# Altium schematic sheet Super_iron.SchDoc
size A4
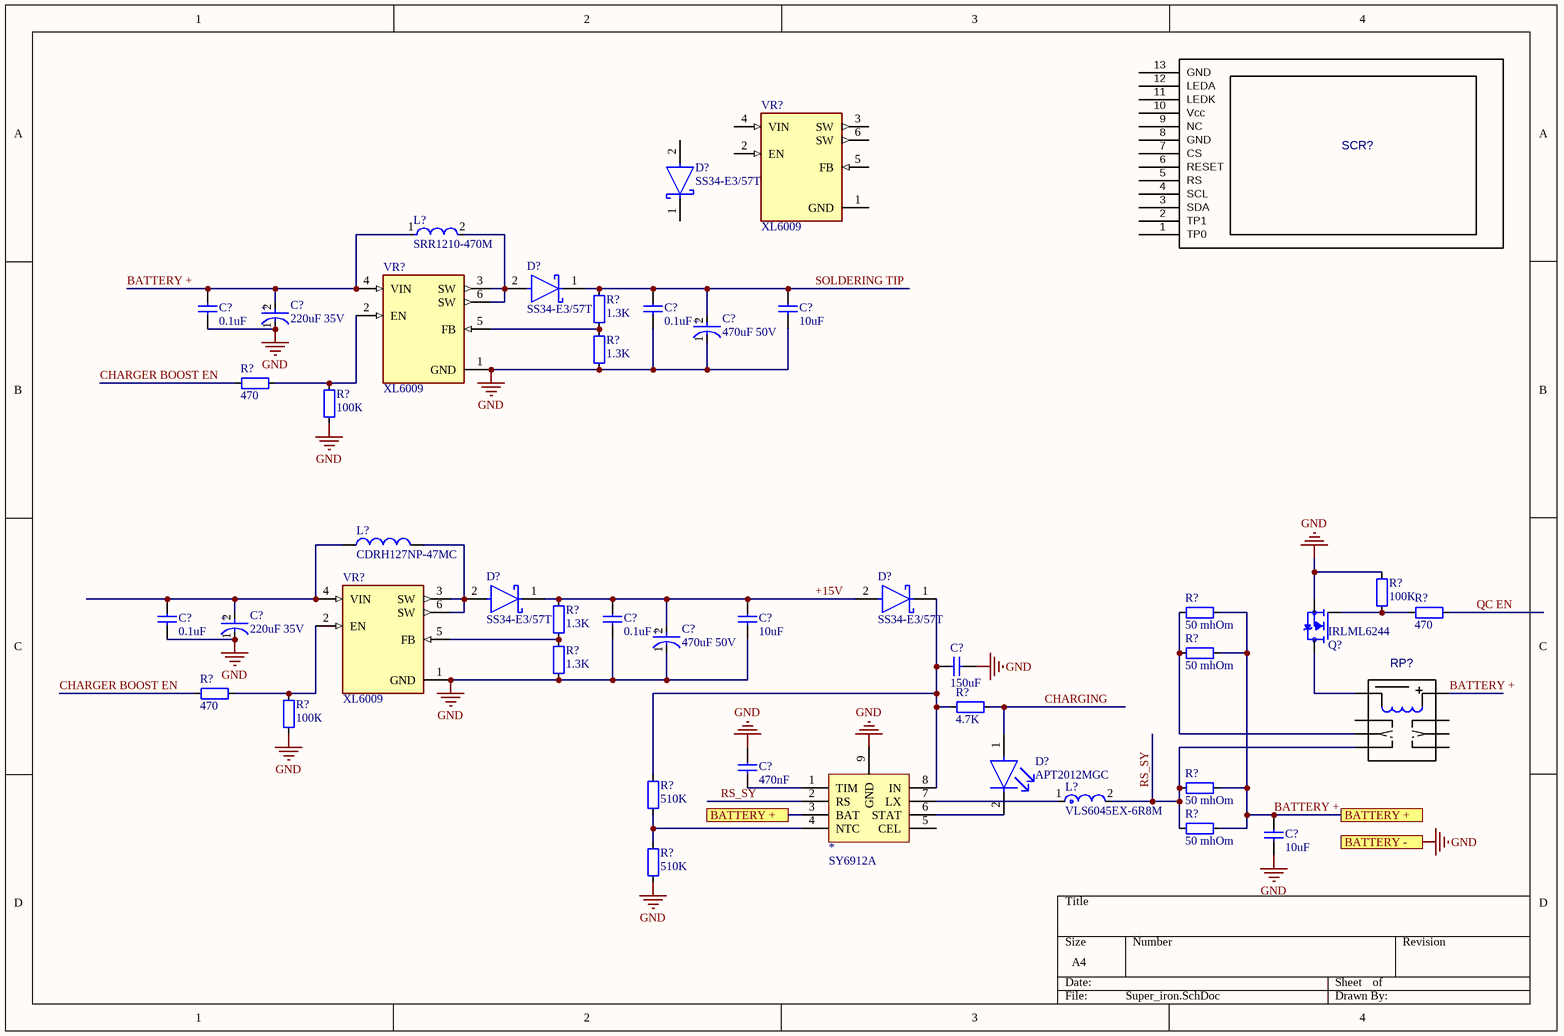
[diagram p0: Super_iron.SchDoc]

## Parts
(Parts that share a designator on the sheet are numbered #1, #2 ... from top to bottom, then left to right.)
*  SY6912A  [SO8]
C?#1  220uF 35V  [FP-RAD-TH-D_8_0_5-L_15_1-MFG]
C?#2  470uF 50V  [FP-RAD-TH-D_10_0_5-L_20_2-MFG]
C?#3  0.1uF  [1206]
C?#4  0.1uF  [1206]
C?#5  10uF  [CAPC1005X04L]
C?#6  220uF 35V  [FP-RAD-TH-D_8_0_5-L_15_1-MFG]
C?#7  470uF 50V  [FP-RAD-TH-D_10_0_5-L_20_2-MFG]
C?#8  0.1uF  [1206]
C?#9  0.1uF  [1206]
C?#10  10uF  [CAPC1005X04L]
C?#11  150uF  [CAPC1005X04L]
C?#12  470nF  [C0805]
C?#13  10uF  [CAPC1005X04L]
D?#1  SS34-E3/57T  [FP-95402-MFG]
D?#2  SS34-E3/57T  [FP-95402-MFG]
D?#3  SS34-E3/57T  [FP-95402-MFG]
D?#4  SS34-E3/57T  [FP-95402-MFG]
D?#5  APT2012MGC  [FP-APT2012MGC-MFG]
L?#1  SRR1210-470M  [FP-SRR1210-MFG]
L?#2  CDRH127NP-47MC  [SUMI-CDRH127_V]
L?#3  VLS6045EX-6R8M  [FP-VLS6045EX-100M-MFG]
Q?  IRLML6244  [SOT-23]
R?#1  1.3K  [C0805]
R?#2  1.3K  [C0805]
R?#3  470  [C0805]
R?#4  100К  [C0805]
R?#5  100К  [C0805]
R?#6  1.3K  [C0805]
R?#7  50 mhOm  [1206]
R?#8  470  [C0805]
R?#9  1.3K  [C0805]
R?#10  50 mhOm  [1206]
R?#11  470  [C0805]
R?#12  100К  [C0805]
R?#13  4.7K  [C0805]
R?#14  510K  [C0805]
R?#15  50 mhOm  [1206]
R?#16  50 mhOm  [1206]
R?#17  510K  [C0805]
RP?  IM03TS  [IM_THT_STANDART]  (value not drawn)
SCR?  0.96INCH_TFT  [0.96INCH_TFT]  (value not drawn)
VR?#1  XL6009  [DPAK170P1435X465-6N]
VR?#2  XL6009  [DPAK170P1435X465-6N]
VR?#3  XL6009  [DPAK170P1435X465-6N]

## Ports
BATTERY +, BATTERY -

## Nets
GND: *.9(GND) C?#1.1(C) C?#2.1(C) C?#3.1 C?#4.1 C?#5.1 C?#6.1(C) C?#7.1(C) C?#8.1 C?#9.1 C?#10.1 C?#11.2 C?#12.2 C?#13.1 Q?.2(S) R?#2.2 R?#4.2 R?#5.1 R?#9.2 R?#12.2 R?#17.2 VR?#2.1(GND) VR?#3.1(GND) ; port BATTERY -
+15V: C?#7.2(A) C?#9.2 C?#10.2 D?#3.1(C) D?#4.2(A) R?#6.1
BATTERY +: *.3(BAT) C?#1.2(A) C?#3.2 C?#13.2 L?#1.1 R?#7.2 R?#10.2 R?#15.2 R?#16.2 VR?#2.4(VIN) ; port BATTERY +
CHARGER BOOST EN: R?#3.2 R?#11.2
CHARGING: D?#5.1(A) R?#13.1
QC EN: R?#8.1
RS_SY: *.2(RS) L?#3.2 R?#15.1 R?#16.1 RP?.4
SOLDERING TIP: C?#2.2(A) C?#4.2 C?#5.2 D?#2.1(C) R?#1.1
Net*_1: *.1(TIM) C?#12.1
Net*_4: *.4(NTC) R?#14.2 R?#17.1
Net*_6: *.6(STAT) D?#5.2(C)
Net*_7: *.7(LX) L?#3.1
Net*_8: *.8(IN) C?#11.1 D?#4.1(C) R?#13.2 R?#14.1
NetC?#6_2: C?#6.2(A) C?#8.2 L?#2.1 VR?#3.4(VIN)
NetD?#2_2: D?#2.2(A) L?#1.2 VR?#2.3(SW) VR?#2.6(SW)
NetD?#3_2: D?#3.2(A) L?#2.2 VR?#3.3(SW) VR?#3.6(SW)
NetQ?_1: Q?.1(G) R?#5.2 R?#8.2
NetQ?_3: Q?.3(D) RP?.1
NetR?#1_2: R?#1.2 R?#2.1 VR?#2.5(FB)
NetR?#3_1: R?#3.1 R?#4.1 VR?#2.2(EN)
NetR?#6_2: R?#6.2 R?#9.1 VR?#3.5(FB)
NetR?#7_1: R?#7.1 R?#10.1 RP?.3
NetR?#11_1: R?#11.1 R?#12.1 VR?#3.2(EN)

Not connected (* = marked no-connect by the designer): * 5(CEL); D?#1 1(C) 2(A); RP? 2 5 6 7 8; SCR? 1(TP0) 2(TP1) 3(SDA) 4(SCL) 5(RS) 6(RESET) 7(CS) 8(GND) 9(NC) 10(Vcc) 11(LEDK) 12(LEDA) 13(GND); VR?#1 1(GND) 2(EN) 3(SW) 4(VIN) 5(FB) 6(SW)

## Buses and harness runs
bus BATTERY +

## Notes on the sheet
- (in symbol CAP 10x20) +
- (in symbol CMP-05427-000678-1) +

## Library data of the parts
C?#1 C?#6 = CMP-05427-000678-1: Aluminum Electrolytic Capacitors (Radial Lead Type) 220uF ±20% 35V; Ripple Current: 1.24A; Impedance: 41mR; Lead Length: 17mm; Life (Hours): 3000Hour; Lead Diameter: 0.6mm; Dielectric Material: Aluminium; Dissipation Factor: 0.12%; Package Quantity: 200; Tolerance: 20%; Series: FM; Voltage Rating: 35V; Lead Pitch: 3.5mm; Radiation Hardening: No; Construction: RADIAL; RoHS Compliant: Yes; REACH SVHC: Yes; Lead Free: Lead Free; Height - Seated (Max): 0.65inch; Length: 15mm; Diameter: 8mm; Mount: Through Hole; Number of Pins: 2; Height: 15mm; Voltage: 35V; Case/Package: Radial; Packaging: Bulk; Min Operating Temperature: -40°C; Voltage Rating (DC): 35V; ESR (Equivalent Series Resistance): 41mR; Capacitance: 220uF; Max Operating Temperature: 105°C; Termination: Radial
C?#2 C?#7 = CAP 10x20: Aluminum Electrolytic Capacitors (Radial Lead Type) 10uF ±20% 400V; Lead/Base Style: Straight; Lead Diameter: 0.6mm; Dissipation Factor: 0.24%; Ripple Current (AC): 80mA; Life (Hours): 2000Hour; Polarity: Polar; Dielectric Material: Aluminium; Lead Free: Lead Free; Capacitance: 10uF; Tolerance: 20%; Height: 20mm; Number of Pins: 2; Case/Package: Radial; Package Quantity: 200; REACH SVHC: No SVHC; Termination: Radial; Radiation Hardening: No; Diameter: 10mm; RoHS Compliant: Yes; Construction: RADIAL; Max Operating Temperature: 105°C; Voltage Rating: 400V; Mount: Through Hole; Voltage: 400V; Height - Seated (Max): 0.866inch; Lead Pitch: 5mm; Voltage Rating (DC): 400V; Contact Plating: Tin; Length: 20mm; Series: NHG; Min Operating Temperature: -25°C; Packaging: Bulk; Ripple Current: 80mA
C?#3-C?#5 C?#8-C?#13 = CAP
  C?#3 C?#4 C?#8 C?#9: Value: 0.1uF
  C?#5 C?#10 C?#13: Value: 10uF
  C?#11: Value: 150uF
  C?#12: Value: 470nF
D?#1-D?#4 = SS34: DIODE SCHOTTKY 40V 3A DO214AB; Manufacturer: Vishay; Max Junction Temp: +150°C; Peak Reverse Current: 0.5mA; Max Surge Forward Current: 100A; Standoff Height: 0mm; ComponentLink2Description: Datasheet; Device Class L3: Schottky Diodes; Height: 2.62mm; Max Repetitive Reverse Voltage: 40V; Lead Free: Yes; Package: 95402; Temperature Range High: +150°C; ComponentLink2URL: http://www.vishay.com/docs/88751/ss32.pdf; Temperature: -55°C to +150°C; Footprint Url: http://www.vishay.com/docs/95402/smc.pdf; Automotive: No; Forward Current: 3A; Category: Diode; Manufacturer Part Number: SS34-E3/57T; RoHS: TRUE; Device Class L2: Diodes; Mouser Description: Schottky Diodes & Rectifiers 3.0 Amp 40 Volt; Octopart: https://octopart.com/ss34-e3%2F57t-vishay-39552907; Temperature Range Low: -55°C; Device Class L1: Discrete Semiconductors; Digikey Description: DIODE SCHOTTKY 40V 3A DO214AB
D?#5 = LED 0805: LED GREEN CLEAR CHIP SMD 0805; Note: LED GREEN CLEAR CHIP SMD 0805
L?#1 = SRR1210: FIXED IND  102 MOHM SMD; Manufacturer: Bourns; Manufacturer Part Number: SRR1210-680M; Inductance: 68uH; Rms Current: 3A; Shielding: true; Q Factor: 12; Value: 68uH; Series Resistance: 102mΩ; Saturation Current: 2.7A; Tolerance: 20%; Core Material: Ferrite; Self Resonant Frequency: 3.8MHz; Test Frequency: 2.52MHz; ComponentLink2Description: Datasheet; Device Class L3: Fixed Inductors; Lead Free: Yes; Composition: Wirewound; Temperature: -40°C to +125°C; Automotive: No; RoHS: TRUE; Category: Ind; Device Class L2: Inductors; Height: 10mm; Temperature Range Low: -40°C; Package: SRR1210; Device Class L1: Passive Components; Temperature Range High: +125°C; Mouser Description: Fixed Inductors 68uH 20% SMD 1210; ComponentLink2URL: https://www.bourns.com/docs/Product-Datasheets/SRR1210.pdf; Digikey Description: FIXED IND 68UH 3A 102 MOHM SMD; Octopart: https://octopart.com/srr1210-680m-bourns-10487145
L?#2 = CMP-2000-06084-1: Power Inductor, 10 uH, +/- 20%, -40 to 100 degC, 2-Pin SMD, RoHS, Tape and Reel; Manufacturer: Sumida; Catalog Drawings: CDRH127SeriesFrontCDRH127SeriesSideCDRH127SeriesBottom; Product Training Modules: PowerInductorBasics; Shielding: Shielded; Online Catalog: CDRHSeries; DC Resistance (DCR): 21.6mOhmMax; Other Names: 308-1457-1; Frequency - Test: 1kHz; Mounting Type: SurfaceMount; Datasheet Version: 01/2014; Package Description: 2-Pin Surface Mount Device, Body 12 x 12 mm; Frequency - Self Resonant: -; Package Reference: CDRH127; Category: Inductors,Coils,Chokes; Material - Core: -; Q @ Freq: -; Type: -; Family: FixedInductors; Ratings: -; Series: CDRH127; Manufacturer URL: http://www.sumida.com/; Operating Temperature: -40°C~100°C; Height - Seated (Max): 0.315"(8.00mm); Standard Package: 1; Size / Dimension: 0.472"Lx0.472"W(12.00mmx12.00mm); Current - Saturation: -; Datasheet URL: http://products.sumida.com/products/pdf/CDRH127.pdf; Package / Case: Nonstandard; Tolerance: ±20%; Mounting Technology: SurfaceMount; Packaging: CutTape(CT)
L?#3 = VLS6045EX: FIXED IND  SMD; Shielding: Shielded; Test Frequency: 100kHz; Core Material: Ferrite; Inductance Tolerance: 20%; DC Resistance (DCR): 61mR; REACH SVHC: No SVHC; Min Operating Temperature: -40°C; RoHS Compliant: Yes; Length: 0.236inch; Lead Free: Lead Free; Packaging: Cut Tape; Width: 0.236inch; Case/Package: Nonstandard; Resistor Type: Wirewound; Height - Seated (Max): 0.177inch; Mount: Surface Mount; Max Operating Temperature: 105°C; Tolerance: 20%
Q? = IRLML6244: MOSFET P-CH 30V 3.6A SOT-23-3; MF: {'manufacturer': u'Infineon Technologies'}; MP: IRLML9301TRPBF; Package: None; Price: None; Value: *; Availability: Unavailable
R?#1-R?#17 = RES SMD UNI: Resistor SMD; Category: Resistors
  R?#1 R?#2 R?#6 R?#9: Value: 1.3K
  R?#3 R?#8 R?#11: Value: 470
  R?#4 R?#5 R?#12: Value: 100К
  R?#7 R?#10 R?#15 R?#16: Value: 50 mhOm
  R?#13: Value: 4.7K
  R?#14 R?#17: Value: 510K
VR?#1-VR?#3 = XL6009: The XL6009 regulator is a wide input range, current mode, DC/DC converter which is capable of generating either positive or negative output voltages.; MF: {'manufacturer': u'XLSEMI'}; Price: None; Package: None; Availability: Unavailable; Value: *; MP: XL6009
RP? = IM03TS: Value: *
SCR? = 0.96INCH_TFT: Value: *